# Altium schematic sheet schematic.schdoc
size 272 x 161 mm
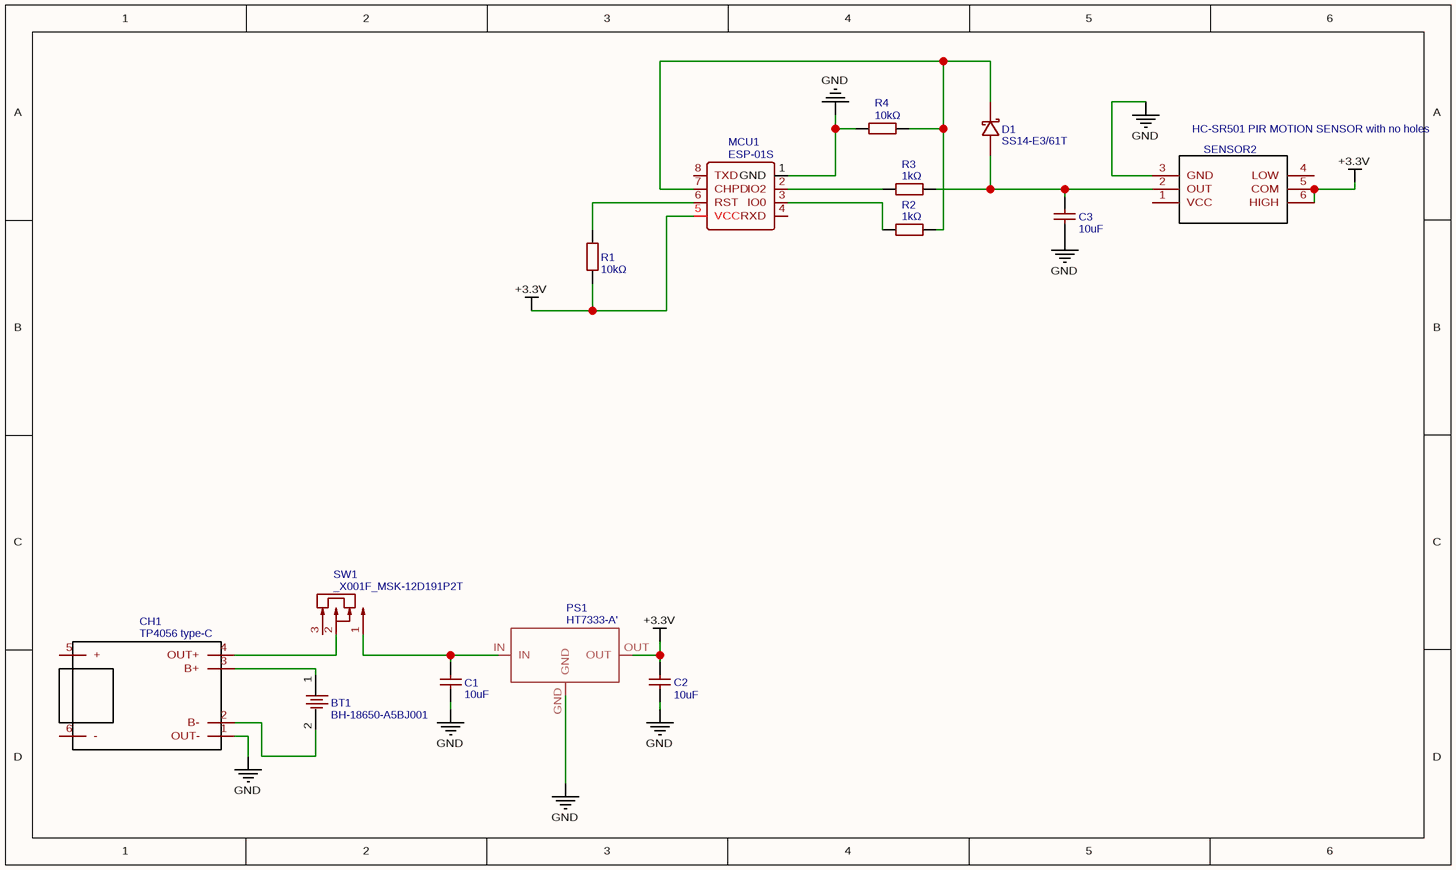
[diagram p0: schematic.schdoc]

## Parts
BT1  BH-18650-A5BJ001  [BAT-TH_18650-A5BJ001]
C1  10uF  [C0805]
C2  10uF  [C0805]
C3  10uF  [C0805]
CH1  TP4056 type-C  [TP4056 TYPE-C MODULE, 18650 1A LIPO BATTERY CHARGING BOARD]
D1  SS14-E3/61T  [SMA_L4.3-W2.6-LS5.2-RD]
MCU1  ESP-01S  [ESP-01S]
PS1  HT7333-A'  [TO92]
R1  10kΩ  [R1206]
R2  1kΩ  [R1206]
R3  1kΩ  [R1206]
R4  10kΩ  [R1206]
SENSOR2  HC-SR501 PIR MOTION SENSOR with no holes  [HC-SR501 PIR MOTION SENSOR WITH NO HOLES (EDITED FROM @RHALF)]
SW1  _X001F_MSK-12D191P2T  [SW-TH_MSK-12D191P2T]

## Nets
+3.3V: C2.1 MCU1.5(VCC) PS1.OUT R1.1 SENSOR2.5(COM) SENSOR2.6(HIGH)
GND: C1.1 C2.2 C3.2 CH1.1(OUT-) MCU1.1(GND) PS1.GND R4.2 SENSOR2.3(GND)
NetBT1_1: BT1.1 CH1.3(B+)
NetBT1_2: BT1.2 CH1.2(B-)
NetC1_2: C1.2 PS1.IN SW1.1
NetC3_1: C3.1 D1.2(A) R3.2 SENSOR2.2(OUT)
NetCH1_4: CH1.4(OUT+) SW1.2
NetD1_1: D1.1(K) MCU1.7(CHPD) R2.2 R4.1
NetMCU1_2: MCU1.2(IO2) R3.1
NetMCU1_3: MCU1.3(IO0) R2.1
NetMCU1_6: MCU1.6(RST) R1.2

Not connected (* = marked no-connect by the designer): CH1 5(+) 6(-); MCU1 4(RXD) 8(TXD); SENSOR2 1(VCC) 4(LOW); SW1 3

## Library data of the parts
BT1 = BH-18650-A5BJ001: Manufacturer: MYOUNG(美阳); Contributor: lcsc; Supplier: LCSC; Supplier Part: C5383220; Manufacturer Part: BH-18650-A5BJ001; JLCPCB Part Class: Extended Part; spicePre: B; spiceSymbolName: BH-18650-A5BJ001
C1-C3 = 10uF: Manufacturer Part: CL21A106KOQNNNE; Manufacturer: SAMSUNG(三星); nameAlias: Value; Supplier: LCSC; Supplier Part: C1713; JLCPCB Part Class: Extended Part; spicePre: C; spiceSymbolName: CL21A106KOQNNNE
CH1 = TP4056 type-C: Contributor: red2211; Supplier: Aliexpress; Supplier Part: 18650 Type-C; link: https://www.aliexpress.com/item/1005001283272516.html; spicePre: U; spiceSymbolName: TP4056 type-C
D1 = SS14-E3/61T: Manufacturer: VISHAY(威世); Supplier: LCSC; Manufacturer Part: SS14-E3/61T; Supplier Part: C47460; JLCPCB Part Class: Extended Part; spicePre: D; spiceSymbolName: SS14-E3/61T
MCU1 = ESP-01S: Manufacturer: Ai-Thinker; Supplier Part: C82893; Supplier: LCSC; Manufacturer Part: ESP-01S; spicePre: M; spiceSymbolName: ESP-01S
PS1 = HT7333-A': Contributor: userweb; spicePre: ?; spiceSymbolName: HT7333-A'
R1 R4 = 10kΩ: Manufacturer: UNI-ROYAL(厚声); Manufacturer Part: 1206W4F1002T5E; nameAlias: Value; Supplier: LCSC; Supplier Part: C17902; JLCPCB Part Class: Basic Part; spicePre: R; spiceSymbolName: 1206W4F1002T5E
R2 R3 = 1kΩ: Manufacturer: UNI-ROYAL(厚声); Manufacturer Part: 1206W4F1001T5E; nameAlias: Value; Supplier: LCSC; Supplier Part: C4410; JLCPCB Part Class: Basic Part; spicePre: R; spiceSymbolName: 1206W4F1001T5E
SENSOR2 = HC-SR501 PIR MOTION SENSOR with no holes: Contributor: aryadpram; spicePre: S; spiceSymbolName: HC-SR501 PIR MOTION SENSOR with no holes
SW1 = _X001F_MSK-12D191P2T: Manufacturer: null; Contributor: lcsc; Supplier: LCSC; Supplier Part: C9900016029; Manufacturer Part: _x001F_MSK-12D191P2T; JLCPCB Part Class: Extended Part; spicePre: U; spiceSymbolName: _X001F_MSK-12D191P2T